# Altium schematic sheet Power_LDO_1V8.SchDoc: 1.8V LDO
size Letter; DrawnBy: Jason Sylvestre; Engineer: Nathan Petersen; DocumentNumber: 6; Revision: v1.2; SheetNumber: 6; SheetTotal: 29
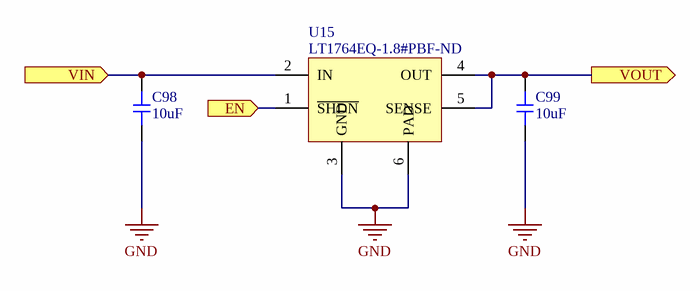
[diagram p0: Power_LDO_1V8.SchDoc]

## Parts
C98  value 10uF  [0603-CAP]  (hidden comment: Capacitor)
C99  value 10uF  [0603-CAP]  (hidden comment: Capacitor)
U15  LT1764EQ-1.8#PBF-ND  [5-DDPAK]

## Ports
EN (in), VIN (in), VOUT (out)

## Nets
GND: C98.2 C99.2 U15.3(GND) U15.6(PAD)
EN: U15.1(~{SHDN}) ; port EN
VIN: C98.1 U15.2(IN) ; port VIN
VOUT: C99.1 U15.4(OUT) U15.5(SENSE) ; port VOUT

## Notes on the sheet
- Title:
- File:
- Sheet:
- of
- Revision:
- Time:
- Date:
- Engineer:

## Library data of the parts
U15 = LT1764EQ-1.8#PBF-ND: IC REG LINEAR 1.8V 3A 5DDPAK; Supplier 1: Digi-Key; Supplier Part Number 1: LT1764EQ-1.8#PBF-ND
C98 C99 = Capacitor: Supplier 1: Digi-Key; Supplier Part Number 1: 1276-1192-6-ND